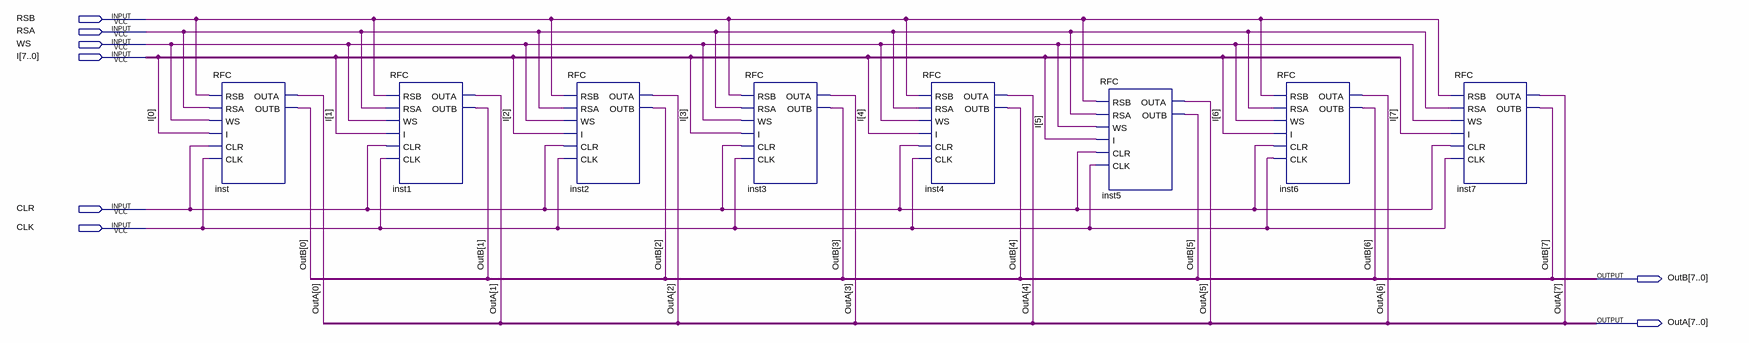
[diagram p0: schematic sheet]
// Quartus schematic RF8bit.bdf as structural Verilog: 8 symbols, 8 pins
module RF8bit (
  input  RSB,
  input  RSA,
  input  WS,
  input  [7:0] I,
  input  CLR,
  input  CLK,
  output [7:0] OutB,
  output [7:0] OutA
);

  RFC inst (.RSB(RSB), .RSA(RSA), .WS(WS), .I(I[0]), .CLR(CLR), .CLK(CLK), .OUTA(OutA[0]), .OUTB(OutB[0]));
  RFC inst1 (.RSB(RSB), .RSA(RSA), .WS(WS), .I(I[1]), .CLR(CLR), .CLK(CLK), .OUTA(OutA[1]), .OUTB(OutB[1]));
  RFC inst2 (.RSB(RSB), .RSA(RSA), .WS(WS), .I(I[2]), .CLR(CLR), .CLK(CLK), .OUTA(OutA[2]), .OUTB(OutB[2]));
  RFC inst3 (.RSB(RSB), .RSA(RSA), .WS(WS), .I(I[3]), .CLR(CLR), .CLK(CLK), .OUTA(OutA[3]), .OUTB(OutB[3]));
  RFC inst4 (.RSB(RSB), .RSA(RSA), .WS(WS), .I(I[4]), .CLR(CLR), .CLK(CLK), .OUTA(OutA[4]), .OUTB(OutB[4]));
  RFC inst5 (.RSB(RSB), .RSA(RSA), .WS(WS), .I(I[5]), .CLR(CLR), .CLK(CLK), .OUTA(OutA[5]), .OUTB(OutB[5]));
  RFC inst6 (.RSB(RSB), .RSA(RSA), .WS(WS), .I(I[6]), .CLR(CLR), .CLK(CLK), .OUTA(OutA[6]), .OUTB(OutB[6]));
  RFC inst7 (.RSB(RSB), .RSA(RSA), .WS(WS), .I(I[7]), .CLR(CLR), .CLK(CLK), .OUTA(OutA[7]), .OUTB(OutB[7]));
endmodule
